# EAGLE board main (EAGLE 6.1)
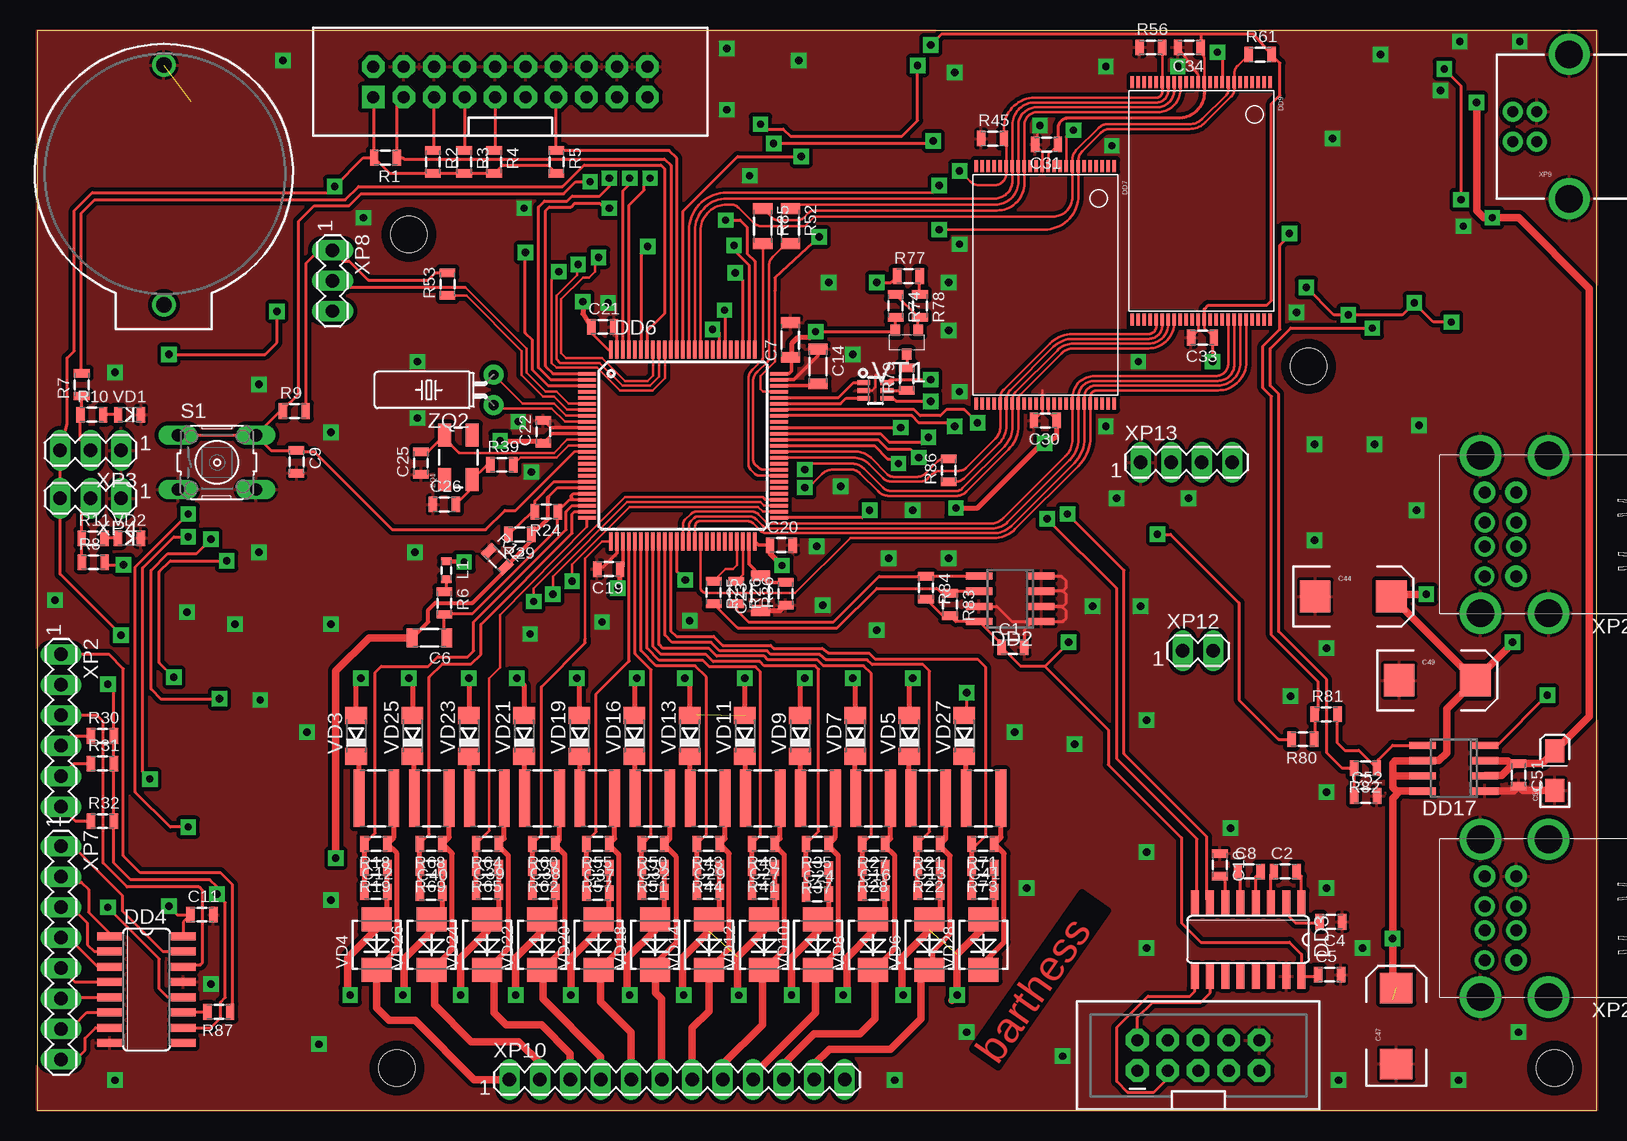
[diagram p5: board, top side]
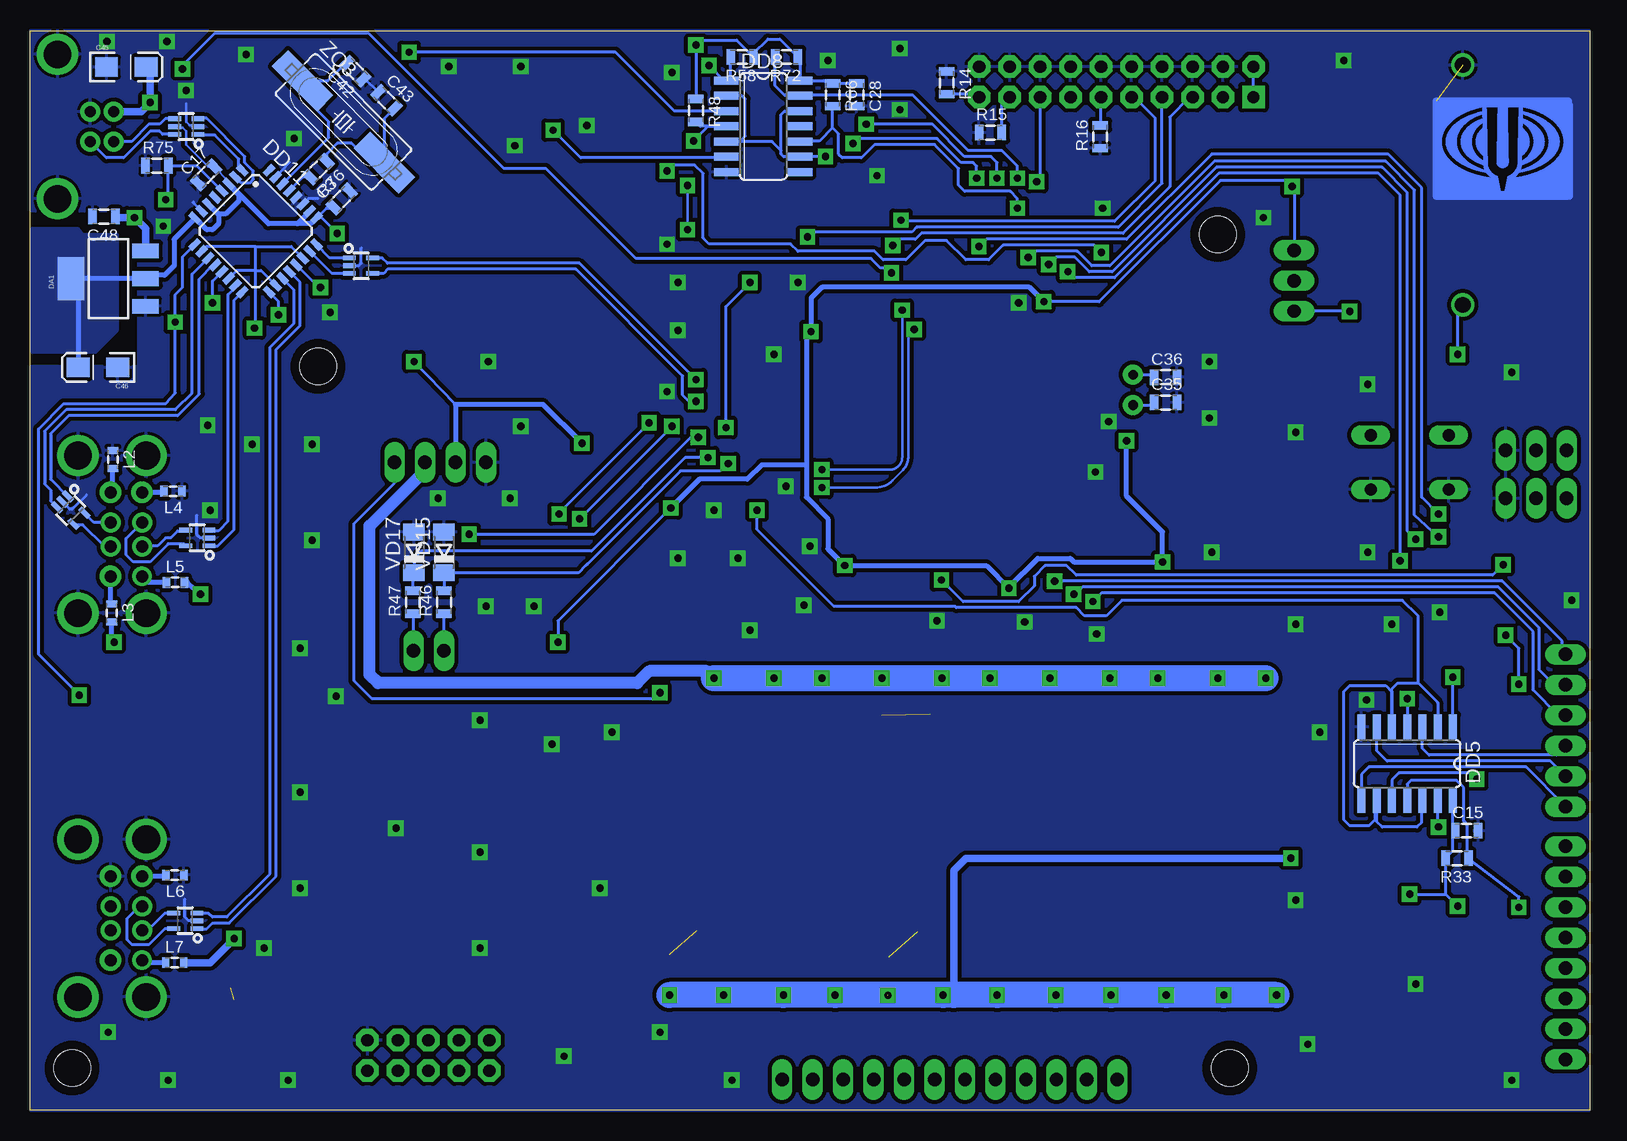
[diagram p6: board, bottom side, seen from below]

Size 130 x 90 mm. Coordinates in mm from the lower left corner, seen from the top.
Outline: 0,0 130,0 130,90 0,90 0,0
Copper layers (1*16): Top 0.035mm / dielectric 1.5mm / Bottom 0.035mm
Design rules: minimum track width 0.2mm, minimum drill 0.3mm, track to track 0.18mm, track to pad 0.15mm, pad to pad 0.15mm, via to via 0.15mm, smd to smd 0.15mm, copper to edge 0mil, drill to drill 30mil, minimum pad ring 12mil, minimum via ring 12mil, stop-mask expansion 4mil, vias tented up to drill 0mil, thermal gap 10mil
tRestrict: area 32.9,53.5 to 33.4,55
bRestrict: area 6.2,82.8 to 6.7,83.4; area 7.9,82.8 to 8.3,83.4

## Footprints (pad centres in the part's own frame; a part is rotated, then mirrored left to right if it is on the bottom)
BATTCOM_20MM_PTH = drill 1.3: 1 20,0; 2 0,0
0805 = smd 0.7 x 1.3: 1 -1,0; 2 0.9,0
1206 = smd 0.9 x 1.6: 1 -1.45,0; 2 1.45,0
EIA7343 = smd 2.55 x 2.7: A 3.17,0; C -3.17,0
EIA3216-KIT = smd 1.9 x 1.6: A 1.65,0; C -1.65,0
SOT223 = smd 1.219 x 2.235: 1 -2.311,-3.099; 2 0,-3.099; 3 2.311,-3.099 | smd 3.6 x 2.2: 4 0,3.099
SO-08 = smd 0.6 x 2.2: 1 -1.905,-2.6; 2 -0.635,-2.6; 3 0.635,-2.6; 4 1.905,-2.6; 5 1.905,2.6; 6 0.635,2.6; 7 -0.635,2.6; 8 -1.905,2.6
SO16 = smd 0.66 x 2.032: 1 -4.445,-3.073; 2 -3.175,-3.073; 3 -1.905,-3.073; 4 -0.635,-3.073; 5 0.635,-3.073; 6 1.905,-3.073; 7 3.175,-3.073; 8 4.445,-3.073; 9 4.445,3.073; 10 3.175,3.073; 11 1.905,3.073; 12 0.635,3.073; 13 -0.635,3.073; 14 -1.905,3.073; 15 -3.175,3.073; 16 -4.445,3.073
SO14 = smd 0.66 x 2.032: 1 -3.81,-3.073; 2 -2.54,-3.073; 3 -1.27,-3.073; 4 0,-3.073; 5 1.27,-3.073; 6 2.54,-3.073; 7 3.81,-3.073; 8 3.81,3.073; 9 2.54,3.073; 10 1.27,3.073; 11 0,3.073; 12 -1.27,3.073; 13 -2.54,3.073; 14 -3.81,3.073
TQFP100 = smd 1.5 x 0.3: 1 -8,6; 2 -8,5.5; 3 -8,5; 4 -8,4.5; 5 -8,4; 6 -8,3.5; 7 -8,3; 8 -8,2.5; 9 -8,2; 10 -8,1.5; 11 -8,1; 12 -8,0.5; 13 -8,0; 14 -8,-0.5; 15 -8,-1; 16 -8,-1.5; 17 -8,-2; 18 -8,-2.5; 19 -8,-3; 20 -8,-3.5; 21 -8,-4; 22 -8,-4.5; 23 -8,-5; 24 -8,-5.5; 25 -8,-6; 51 8,-6; 52 8,-5.5; 53 8,-5; 54 8,-4.5; 55 8,-4; 56 8,-3.5; 57 8,-3; 58 8,-2.5; 59 8,-2; 60 8,-1.5; 61 8,-1; 62 8,-0.5; 63 8,0; 64 8,0.5; 65 8,1; 66 8,1.5; 67 8,2; 68 8,2.5; 69 8,3; 70 8,3.5; 71 8,4; 72 8,4.5; 73 8,5; 74 8,5.5; 75 8,6 | smd 0.3 x 1.5: 26 -6,-8; 27 -5.5,-8; 28 -5,-8; 29 -4.5,-8; 30 -4,-8; 31 -3.5,-8; 32 -3,-8; 33 -2.5,-8; 34 -2,-8; 35 -1.5,-8; 36 -1,-8; 37 -0.5,-8; 38 0,-8; 39 0.5,-8; 40 1,-8; 41 1.5,-8; 42 2,-8; 43 2.5,-8; 44 3,-8; 45 3.5,-8; 46 4,-8; 47 4.5,-8; 48 5,-8; 49 5.5,-8; 50 6,-8; 76 6,8; 77 5.5,8; 78 5,8; 79 4.5,8; 80 4,8; 81 3.5,8; 82 3,8; 83 2.5,8; 84 2,8; 85 1.5,8; 86 1,8; 87 0.5,8; 88 0,8; 89 -0.5,8; 90 -1,8; 91 -1.5,8; 92 -2,8; 93 -2.5,8; 94 -3,8; 95 -3.5,8; 96 -4,8; 97 -4.5,8; 98 -5,8; 99 -5.5,8; 100 -6,8
TSOP48 = smd 1 x 0.3: 1 -0.7,11.8; 2 -0.7,11.3; 3 -0.7,10.8; 4 -0.7,10.3; 5 -0.7,9.8; 6 -0.7,9.3; 7 -0.7,8.8; 8 -0.7,8.3; 9 -0.7,7.8; 10 -0.7,7.3; 11 -0.7,6.8; 12 -0.7,6.3; 13 -0.7,5.8; 14 -0.7,5.3; 15 -0.7,4.8; 16 -0.7,4.3; 17 -0.7,3.8; 18 -0.7,3.3; 19 -0.7,2.8; 20 -0.7,2.3; 21 -0.7,1.8; 22 -0.7,1.3; 23 -0.7,0.8; 24 -0.7,0.3; 25 19.1,0.3; 26 19.1,0.8; 27 19.1,1.3; 28 19.1,1.8; 29 19.1,2.3; 30 19.1,2.8; 31 19.1,3.3; 32 19.1,3.8; 33 19.1,4.3; 34 19.1,4.8; 35 19.1,5.3; 36 19.1,5.8; 37 19.1,6.3; 38 19.1,6.8; 39 19.1,7.3; 40 19.1,7.8; 41 19.1,8.3; 42 19.1,8.8; 43 19.1,9.3; 44 19.1,9.8; 45 19.1,10.3; 46 19.1,10.8; 47 19.1,11.3; 48 19.1,11.8
SOTT323-6L = smd 1.05 x 0.4: 1 -1,0.65; 2 -1,0; 3 -1,-0.65; 4 0.95,-0.65; 5 0.95,0; 6 0.95,0.65
VF_S-PQFP-G32 = smd 1.05 x 0.5: 1 -4.375,2.8; 2 -4.375,2; 3 -4.375,1.2; 4 -4.375,0.4; 5 -4.375,-0.4; 6 -4.375,-1.2; 7 -4.375,-2; 8 -4.375,-2.8; 17 4.375,-2.8; 18 4.375,-2; 19 4.375,-1.2; 20 4.375,-0.4; 21 4.375,0.4; 22 4.375,1.2; 23 4.375,2; 24 4.375,2.8 | smd 0.5 x 1.05: 9 -2.8,-4.375; 10 -2,-4.375; 11 -1.2,-4.375; 12 -0.4,-4.375; 13 0.4,-4.375; 14 1.2,-4.375; 15 2,-4.375; 16 2.8,-4.375; 25 2.8,4.375; 26 2,4.375; 27 1.2,4.375; 28 0.4,4.375; 29 -0.4,4.375; 30 -1.2,4.375; 31 -2,4.375; 32 -2.8,4.375
SOTT323-5L = smd 1.05 x 0.4: 1 -1,0.65; 2 -1,0; 3 -1,-0.65; 4 0.95,-0.65; 5 0.95,0.65
STAND-OFF-TIGHT = hole 3.048: 0,0
0603 = smd 0.6 x 0.9: 1 -0.8,0; 2 0.7,0
1218 = smd 0.9 x 4.8: 1 -1.45,0; 2 1.45,0
B3F-10XX = drill 1.016 long: 1 -3.251,2.261; 2 3.251,2.261; 3 -3.251,-2.261; 4 3.251,-2.261
LED-0805 = smd 0.7 x 1.3: A -1,0; C 0.9,0
SOD80C = smd 1.4 x 1.8: A 1.7,0; C -1.7,0
SMB = smd 2 x 2.5: A 2.1,0; C -2.1,0
MICRO3 = smd 0.8 x 0.9: 1 -0.95,-1; 2 0.95,-1; 3 0,1
PLD_2X10_SHROUDED = drill 1.016 pad 1.88 square: 1 -1.27,11.43 | drill 1.016 pad 1.88 octagon: 2 1.27,11.43; 3 -1.27,8.89; 4 1.27,8.89; 5 -1.27,6.35; 6 1.27,6.35; 7 -1.27,3.81; 8 1.27,3.81; 9 -1.27,1.27; 10 1.27,1.27; 11 -1.27,-1.27; 12 1.27,-1.27; 13 -1.27,-3.81; 14 1.27,-3.81; 15 -1.27,-6.35; 16 1.27,-6.35; 17 -1.27,-8.89; 18 1.27,-8.89; 19 -1.27,-11.43; 20 1.27,-11.43
PLD_1X06_LONGPAD = drill 1.118 long: 1 0,0; 2 2.54,0; 3 5.08,0; 4 7.62,0; 5 10.16,0; 6 12.7,0
PLD_1X03_LONGPAD = drill 1.118 long: 1 0,0; 2 2.54,0; 3 5.08,0
2X5-SHROUDED = drill 1.016 pad 1.88 octagon: 1 -1.27,5.08; 2 1.27,5.08; 3 -1.27,2.54; 4 1.27,2.54; 5 -1.27,0; 6 1.27,0; 7 -1.27,-2.54; 8 1.27,-2.54; 9 -1.27,-5.08; 10 1.27,-5.08
PLD_1X08_LONGPAD = drill 1.118 long: 1 0,0; 2 2.54,0; 3 5.08,0; 4 7.62,0; 5 10.16,0; 6 12.7,0; 7 15.24,0; 8 17.78,0
USB-B-PTH = drill 0.914 pad 1.676: D+ 0,1.25; D- 1.981,1.25; GND 0,-1.25; VBUS 1.981,-1.25 | drill 2.286: S1 -2.718,-6.02; S2 -2.718,6.02
PLD_1X12_LONGPAD = drill 1.118 long: 1 0,0; 2 2.54,0; 3 5.08,0; 4 7.62,0; 5 10.16,0; 6 12.7,0; 7 15.24,0; 8 17.78,0; 9 20.32,0; 10 22.86,0; 11 25.4,0; 12 27.94,0
PLD_1X02_LONGPAD = drill 1.118 long: 1 0,0; 2 2.54,0
PLD_1X04_LONGPAD = drill 1.118 long: 1 0,0; 2 2.54,0; 3 5.08,0; 4 7.62,0
2_USB_A_ANGLE = drill 1 pad 1.676: 1D+ 2.71,-1; 1D- 2.71,1; 2D+ 5.33,-1; 2D- 5.33,1 | drill 1 pad 1.778: 1GND 2.71,-3.5; 1VBUS 2.71,3.5; 2GND 5.33,-3.5 | drill 1: 2VBUS 5.33,3.5 | drill 2.3: M1 0,6.57; M2 0,-6.57; M3 5.68,6.57; M4 5.68,-6.57
CRYSTAL-SMD-5X3 = smd 1.9 x 1.1: 1 -1.85,-1.15; 2 1.85,-1.15; 3 1.85,1.15; 4 -1.85,1.15
TC38H = drill 0.813 pad 1.676: 1 -1.27,0; 2 1.27,0
HC49UP = smd 5.334 x 1.93: 1 -4.826,0; 2 4.826,0

## Placement (x,y rotation side)
BAT1  3V  [BATTCOM_20MM_PTH]  10.57,87.12 270 top
C1  0.1uF  [0805]  81.4,38.6 0 top
C2  0.1uF  [0805]  104.1,19.9 0 top
C3  0.1uF  [0805]  104,76 45 bottom
C4  0.1uF  [0805]  107.8,15.7 180 top
C5  0.1uF  [0805]  107.8,11.3 0 top
C6  10uF  [1206]  32.71,39.37 180 top
C7  10uF  [1206]  62.8,64.2 90 top
C8  0.1uF  [0805]  101.1,19.9 0 top
C9  0.1uF  [0805]  21.63,54 270 top
C10  0.1uF  [0805]  98.6,20.4 270 top
C11  0.1uF  [0805]  13.8,16.3 0 top
C12  1uF/10v  [0805]  28.3,18.2 0 top
C13  1uF/10v  [0805]  74.4,18.2 0 top
C14  4.7uF  [1206]  65.1,62 270 top
C15  0.1uF  [0805]  10.2,23.3 0 bottom
C16  1uF/10v  [0805]  69.8,18.1 0 top
C17  0.1uF  [0805]  115.3,78 45 bottom
C19  0.1uF  [0805]  47.6,45.1 180 top
C20  0.1uF  [0805]  62.1,47.1 0 top
C21  0.1uF  [0805]  47.2,65.3 0 top
C22  0.1uF  [0805]  42.2,56.6 90 top
C23  4.7uF  [1206]  60.3,43.1 90 top
C24  1uF/10v  [0805]  65.1,18 0 top
C25  22pF/50v  [0805]  32,54 90 top
C26  22pF/50v  [0805]  34,50.5 0 top
C27  1uF/10v  [0805]  60.6,18.2 0 top
C28  0.1uF  [0805]  61.1,84.6 270 bottom
C29  1uF/10v  [0805]  56,18.2 0 top
C30  0.1uF  [0805]  84,57.5 180 top
C31  0.1uF  [0805]  84.1,80.5 180 top
C32  1uF/10v  [0805]  51.4,18.2 0 top
C33  0.1uF  [0805]  97.1,64.4 180 top
C34  0.1uF  [0805]  96,88.6 180 top
C35  10pF  [0805]  35.3,59 0 bottom
C36  10pF  [0805]  35.3,61.1 0 bottom
C37  1uF/10v  [0805]  46.8,18.1 0 top
C38  1uF/10v  [0805]  42.3,18.2 0 top
C39  1uF/10v  [0805]  37.6,18.2 0 top
C40  1uF/10v  [0805]  32.9,18.1 0 top
C41  1uF/10v  [0805]  78.9,18.2 0 top
C42  22pF/50v  [0805]  102.96,86.66 135 bottom
C43  22pF/50v  [0805]  100.26,84.16 315 bottom
C44  100uF/10v  [EIA7343]  109.72,42.82 0 top
C45  10uF/6.3v  [EIA3216-KIT]  121.98,86.96 0 bottom
C46  10uF/6.3v  [EIA3216-KIT]  124.34,61.92 180 bottom
C47  100uF/10v  [EIA7343]  113.3,7.02 90 top
C48  0.1uF  [0805]  123.9,74.5 180 bottom
C49  100uF/10v  [EIA7343]  116.72,35.84 0 top
C50  10uF/6.3v  [EIA3216-KIT]  126.52,28.3 90 top
C51  0.1uF  [0805]  123.5,27.9 270 top
C52  0.1uF  [0805]  110.8,26.2 0 top
DA1  LM1117  [SOT223]  123.48,69.32 90 bottom
DD2  24AA32ASN  [SO-08]  81.12,42.63 90 top
DD3  MAX3232CSE  [SO16]  100.95,14.22 180 top
DD4  74HC595D  [SO16]  9.12,10.05 270 top
DD5  74HC125D  [SO14]  15.21,28.88 180 bottom
DD6  STM32F103VDT6  [TQFP100]  53.84,55.39 0 top
DD7  K9LBG08U0D  [TSOP48]  78,78 270 top
DD8  74HC125D  [SO14]  68.88,82.02 270 bottom
DD9  K9LBG08U0D  [TSOP48]  91,85 270 top
DD10  USBUF01W6  [SOTT323-6L]  117,82 180 bottom
DD11  TUSB2046BVFR  [VF_S-PQFP-G32]  111.2,73.28 315 bottom
DD12  USBDF01W5  [SOTT323-5L]  126.6,50 315 bottom
DD13  USBUF01W6  [SOTT323-6L]  69.9,60 0 top
DD14  USBDF01W5  [SOTT323-5L]  102.4,70.4 0 bottom
DD15  USBDF01W5  [SOTT323-5L]  116.08,47.7 180 bottom
DD16  USBDF01W5  [SOTT323-5L]  117.08,15.78 180 bottom
DD17  TPS2041D  [SO-08]  118.1,28.5 90 top
JP1  STAND-OFFTIGHT  [STAND-OFF-TIGHT]  30,3.5 0 top
JP2  STAND-OFFTIGHT  [STAND-OFF-TIGHT]  126.5,3.5 0 top
JP6  STAND-OFFTIGHT  [STAND-OFF-TIGHT]  31,73 0 top
JP7  STAND-OFFTIGHT  [STAND-OFF-TIGHT]  106,62 0 top
L1  EXC3BP  [0603]  34.12,44.95 270 top
L2  EXC3BP  [0603]  123.1,54.18 270 bottom
L3  EXC3BP  [0603]  123.2,41.4 270 bottom
L4  EXC3BP  [0603]  118.14,51.6 180 bottom
L5  EXC3BP  [0603]  117.84,44 0 bottom
L6  EXC3BP  [0603]  117.98,19.6 180 bottom
L7  EXC3BP  [0603]  117.9,12.3 0 bottom
R1  10k  [0805]  29,79.4 180 top
R2  10k  [0805]  33,79 270 top
R3  10k  [0805]  35.6,79 270 top
R4  10k  [0805]  38.1,79 270 top
R5  10k  [0805]  43.3,79 270 top
R6  2.2  [0805]  33.95,42.22 270 top
R7  10k  [0805]  3.72,60.53 90 top
R8  10k  [0805]  4.74,45.68 0 top
R9  10k  [0805]  21.49,58.28 0 top
R10  100  [0805]  4.61,57.98 0 top
R11  100  [0805]  4.72,47.68 0 top
R12  0  [0805]  38.4,45.9 315 top
R14  10k  [0805]  53.6,85.6 270 bottom
R15  10k  [0805]  49.9,81.5 0 bottom
R16  10k  [0805]  40.8,81.2 90 bottom
R17  1k/1%  [1218]  28.3,26 180 top
R18  100k/1%  [0805]  28.2,22.2 180 top
R19  10k/1%  [0805]  28.2,20.2 180 top
R20  1k/1%  [1218]  74.3,26 180 top
R21  100k/1%  [0805]  74.3,22.2 180 top
R22  10k/1%  [0805]  74.3,20.2 180 top
R23  1k/1%  [1218]  69.7,26 180 top
R24  0  [0805]  42.4,49.9 180 top
R25  0  [0805]  56.4,43.1 270 top
R26  0  [0805]  58.3,43.1 270 top
R27  100k/1%  [0805]  69.7,22.2 180 top
R28  10k/1%  [0805]  69.7,20.2 180 top
R29  0  [0805]  40.2,48 180 top
R30  10k  [0805]  5.5,31.2 0 top
R31  10k  [0805]  5.5,28.9 0 top
R32  10k  [0805]  5.5,24.1 0 top
R33  10k  [0805]  11.1,21 180 bottom
R34  1k/1%  [1218]  65.1,26 180 top
R35  100k/1%  [0805]  65,22.2 180 top
R36  0  [0805]  62.4,43.1 90 top
R37  10k/1%  [0805]  65,20.1 180 top
R38  1k/1%  [1218]  60.5,26 180 top
R39  390  [0805]  38.8,53.8 0 top
R40  100k/1%  [0805]  60.5,22.2 180 top
R41  10k/1%  [0805]  60.5,20.2 180 top
R42  1k/1%  [1218]  55.9,26 180 top
R43  100k/1%  [0805]  55.9,22.2 180 top
R44  10k/1%  [0805]  55.9,20.2 180 top
R45  10k  [0805]  79.7,81 0 top
R46  10k  [0805]  95.5,42.4 90 bottom
R47  10k  [0805]  98.1,42.4 90 bottom
R48  10k  [0805]  74.5,83.3 270 bottom
R49  1k/1%  [1218]  51.3,26 180 top
R50  100k/1%  [0805]  51.3,22.2 180 top
R51  10k/1%  [0805]  51.3,20.2 180 top
R52  0  [1206]  62.8,73.7 270 top
R53  10k  [0805]  34.21,68.91 90 top
R54  1k/1%  [1218]  46.7,26 180 top
R55  100k/1%  [0805]  46.7,22.2 180 top
R56  10k  [0805]  92.9,88.6 0 top
R57  10k/1%  [0805]  46.7,20.2 180 top
R58  10k  [0805]  70.7,87.8 180 bottom
R59  1k/1%  [1218]  42.1,26 180 top
R60  100k/1%  [0805]  42.2,22.2 180 top
R61  10k  [0805]  102,88 0 top
R62  10k/1%  [0805]  42.2,20.2 180 top
R63  1k/1%  [1218]  37.5,26 180 top
R64  100k/1%  [0805]  37.5,22.2 180 top
R65  10k/1%  [0805]  37.5,20.2 180 top
R66  10k  [0805]  63.1,84.6 270 bottom
R67  1k/1%  [1218]  32.9,26 180 top
R68  100k/1%  [0805]  32.8,22.2 180 top
R69  10k/1%  [0805]  32.8,20.2 180 top
R70  1k/1%  [1218]  78.9,26 180 top
R71  100k/1%  [0805]  78.8,22.2 180 top
R72  10k  [0805]  67,87.8 180 bottom
R73  10k/1%  [0805]  78.8,20.2 180 top
R74  10k  [0805]  71.56,67 270 top
R75  10k  [0805]  119.38,78.74 0 bottom
R76  1.5k  [0805]  106,78.4 225 bottom
R77  0  [0805]  72.69,69.53 0 top
R78  1.5k  [0805]  73.6,67 270 top
R79  1.5k  [0805]  72.5,61 90 top
R80  10k  [0805]  105.46,30.92 180 top
R81  1k  [0805]  107.5,33 0 top
R82  10k  [0805]  110.68,28.5 180 top
R83  1.5k  [0805]  76.1,42.1 270 top
R84  1.5k  [0805]  74.1,43.5 270 top
R85  0  [1206]  60.5,73.7 270 top
R86  0  [0805]  76,53.4 90 top
R87  0  [0805]  15.1,8.2 180 top
S1  [B3F-10XX]  15,54 0 top
VD1  RED  [LED-0805]  7.76,57.98 0 top
VD2  RED  [LED-0805]  7.75,47.68 0 top
VD3  BAS85  [SOD80C]  26.6,31.2 90 top
VD4  SM6T30A  [SMB]  28.3,13.8 90 top
VD5  BAS85  [SOD80C]  72.7,31.2 90 top
VD6  SM6T30A  [SMB]  74.4,13.8 90 top
VD7  BAS85  [SOD80C]  68.2,31.2 90 top
VD8  SM6T30A  [SMB]  69.7,13.8 90 top
VD9  BAS85  [SOD80C]  63.6,31.2 90 top
VD10  SM6T30A  [SMB]  65.1,13.8 90 top
VD11  BAS85  [SOD80C]  59,31.2 90 top
VD12  SM6T30A  [SMB]  60.6,13.8 90 top
VD13  BAS85  [SOD80C]  54.4,31.2 90 top
VD14  SM6T30A  [SMB]  56,13.8 90 top
VD15  BZV55-C3V3  [SOD80C]  95.5,46.5 90 bottom
VD16  BAS85  [SOD80C]  49.8,31.2 90 top
VD17  BZV55-C3V3  [SOD80C]  98,46.5 90 bottom
VD18  SM6T30A  [SMB]  51.5,13.8 90 top
VD19  BAS85  [SOD80C]  45.2,31.2 90 top
VD20  SM6T30A  [SMB]  46.8,13.8 90 top
VD21  BAS85  [SOD80C]  40.6,31.2 90 top
VD22  SM6T30A  [SMB]  42.1,13.8 90 top
VD23  BAS85  [SOD80C]  36,31.2 90 top
VD24  SM6T30A  [SMB]  37.5,13.8 90 top
VD25  BAS85  [SOD80C]  31.3,31.2 90 top
VD26  SM6T30A  [SMB]  32.9,13.8 90 top
VD27  BAS85  [SOD80C]  77.3,31.2 90 top
VD28  SM6T30A  [SMB]  78.9,13.8 90 top
VT1  IRLML5103  [MICRO3]  72.5,64.02 180 top
XP1  2X10-SHROUDED  [PLD_2X10_SHROUDED]  39.45,85.72 90 top
XP2  [PLD_1X06_LONGPAD]  2,38 270 top
XP3  [PLD_1X03_LONGPAD]  7,55 180 top
XP4  [PLD_1X03_LONGPAD]  7,51 180 top
XP5  M05X2SHD  [2X5-SHROUDED]  96.8,4.56 90 top
XP7  [PLD_1X08_LONGPAD]  2,22 270 top
XP8  [PLD_1X03_LONGPAD]  24.63,71.69 270 top
XP9  USB-B  [USB-B-PTH]  125,82 180 top
XP10  [PLD_1X12_LONGPAD]  39.37,2.54 0 top
XP12  [PLD_1X02_LONGPAD]  95.5,38.3 0 top
XP13  [PLD_1X04_LONGPAD]  92,54 0 top
XP22  USB_2PSHIELD-  [2_USB_A_ANGLE]  126,48 180 top
XP23  USB_2PSHIELD-  [2_USB_A_ANGLE]  126,16 180 top
ZQ1  12M  [CRYSTAL-SMD-5X3]  35.12,54.42 90 top
ZQ2  32k  [TC38H]  38.06,60.04 90 top
ZQ3  6M  [HC49UP]  103.88,82.4 315 bottom

## Tracks (layer width: path | path; a pad name or v marks a point on that pad's centre or on a via)
3.3V  (via drill 0.6 pad 1.27)
  Top 0.2: C34.1 97.3,87.7 DD9.12 | C31.1 84.3,79.7 DD7.12 | DD9.37 97.3,65.2 C33.1 | DD7.37 84.3,58.2 C30.1
  Top 0.25: C31.1 85.1,81.94 arc-90 86.06,82.7 95.26,82.7 arc90 97.3,84.94 DD9.12 | C5.1 106.65,11.15 DD3.16 105.39,13.01 104.4,14 97,14 95.4,15.6 95.4,22.7 89.3,28.8 89.3,31.7 84,37 | 62.9,62.65 C7.1 | C22.1 42.99,56.39 | DD4.16 12.19,15.69 C11.1 11.7,16.3 v11,17 | R1.2 28.1,84.37 XP1.1 | DD4.10 14.47,6.88 15.3,7.7 15.3,9 15.7,9.4 15.7,17.3 v15,18 15,18.6 14.4,19.2 7.8,19.2 6.4,20.6 R32.2 R31.2 R30.2 6.4,35 v5.9,35.5 | R5.2 42.6,78.8 38.8,78.8 R4.2 R3.2 R2.2 29.4,78.1 R1.2 | v98,62.4 98,63.8 C33.1 | C19.1 48.84,45.34 | R74.2 VT1.2 71.43,64.9 v64.9,64.9 | R84.2 75.5,41.2 R83.2 76.58,40.73 DD2.8 80.4,38.84 C1.1 82,37 84,37 | v86,39 84,37 | R1.2 27.2,79.4 v24.8,77 24.3,76.5 4.6,76.5 3.1,75 3.1,63.3 2.5,62.7 2.5,57.2 XP3.3 | R53.2 33.21,69.81 32.6,69.2 27.6,69.2 26,70.8 25.52,70.8 XP8.1 23.5,71.7 22.39,70.59 R9.2 | XP3.3 2,55.08 | XP3.3 XP4.3 1.92,44.68 v7,39.6 | 97,89.7 101.4,89.7 R61.2 103.6,87.3 103.6,84.6 102.9,83.9 102.9,67.5 102.5,67.1 97.6,67.1 97.3,66.8 DD9.37 | 97,89.7 75.4,89.7 v74.5,88.8 | 97,89.7 C34.1 | DD6.100 47.61,63.39 46,65 46,65.1 C21.1
  Top 0.3: DD6.75 62.69,61.39 62.9,61.6 62.9,62.65 | 42.99,56.39 DD6.11 | C20.1 60.13,47.1 DD6.50 | 48.84,45.34 DD6.28
  Top 0.406: 85,57 C30.1 85,56.1 v84,55.6 83.8,55.6 78.4,50.2 v76.6,50.2 | 62.9,62.65 62.9,63.9 63.4,64.4 64.4,64.4 v64.9,64.9 | C20.1 61.1,46.4 v62.1,45.4 | C19.1 48.6,43.7 v48.4,43.5 | C22.1 42,55.8 v38.6,55.8 | v45.5,67.4 45.5,66.4 C21.1 | v35.6,45.7 35.02,45.7 L1.1
  Bottom 0.25: DD5.14 11.4,23.5 C15.1 11.4,23.1 11.4,21.6 R33.2 12,18 | C28.1 R66.1 63.5,85.5 63.83,85.83 DD8.14 65.81,87.61 R72.1 67.5,89.3 68.5,89.3 69.7,88.1 R58.1 71.1,89.2 74.1,89.2 v74.5,88.8 R48.1 | 28.2,84.27 XP1.1 XP1.2 | v15,18 12,18 | 12,18 v11,17 | 94.54,58.84 v98,62.4 | v76.6,50.2 86,40.8 v86,39 | XP8.1 24.63,76.83 v24.8,77 25.3,77.5 30.8,77.5 40.9,67.4 v45.5,67.4 | v5.9,35.5 5.9,38.5 v7,39.6
  Bottom 0.406: 65.3,53.8 65.3,51.1 63.5,49.3 63.5,46.8 v62.1,45.4 50.3,45.4 v48.4,43.5 48.4,43.6 46,46 43.3,46 43,45.7 v35.6,45.7 35.6,48.2 38.6,51.2 v38.6,55.8 | 65.3,53.8 65.3,64.5 v64.9,64.9 64.9,67.7 64,68.6 46.7,68.6 v45.5,67.4 | XP13.2 94.54,58.84 87.24,58.84 v84,55.6 | v76.6,50.2 74.2,52.6 70.2,52.6 69,53.8 65.3,53.8
3.3V_USB  (via drill 0.6 pad 1.27)
  Top 0.25: v104.4,73.1 104.4,72.9 103.6,72.1 103.6,65.1 102.2,63.7 102.2,60.2 102.9,59.5 102.9,39.6 106.8,35.7 106.8,33.3 R81.1 106.5,30.96 R80.1
  Bottom 0.2: DD10.5 117.85,81.9 117.3,81.9 117,81.6 117,80.5 115.14,78.64 C17.2 113.44,77.42 DD11.3
  Bottom 0.25: v104.4,73.1 105.69,74.39 DD11.25 106.11,74.39 105.3,75.2 104.8,75.2 C3.1
  Bottom 0.406: 126,69.32 DA1.2 120.1,69.6 118.8,69.6 118,70.4 118,72.6 116.27,74.33 DD11.8 115.28,73.4 114.8,73.4 114.3,73.9 114.3,74.7 115.12,75.53 DD11.6 114.32,74.7 113.7,74.7 112.6,75.8 112.6,76.3 113.44,77.14 DD11.3 110.12,73.9 107.7,73.9 | 126,69.32 DA1.4 | 107.7,73.9 106.69,74.91 DD11.26 | DD11.25 106.62,73.9 107.7,73.9 | C46.A 126,69.32
  pour Bottom (isolate 0.3, no thermals): 122.7,73 125.6,73 126,73.5 129.9,73.5 129.9,63.2 124.5,63.2 122.7,65
5V_USB  (via drill 0.6 pad 1.27)
  Top 0.61: 122.8,28.9 C51.1 125.47,28.9 C50.A 129.4,32.83 129.4,68.5 123.5,74.4 v121.3,74.4 120.6,74.4 120,75 v120,84 | 122.8,28.9 122.6,29.1 120.73,29.1 DD17.3 | DD17.2 120.73,27.9 122.1,27.9 122.8,28.6 122.8,28.9
  Bottom 0.61: DA1.3 120.38,73.48 v121.3,74.4 122.8,74.4 C48.1 | C45.A 120,86.63 v120,84 120.75,83.25 XP9.VBUS
!USB_HUB_RESET  (via drill 0.6 pad 1.27)
  Top 0.25: v117.3,86.8 118.7,85.4 v118.7,75.9 | DD6.78 58.84,69.16 v58.2,69.8
  Bottom 0.25: DD11.4 116.09,78.74 R75.2 118.48,76.12 v118.7,75.9 | v117.3,86.8 117.3,87.1 114.6,89.8 101.8,89.8 90.5,78.5 87,78.5 79.5,71 59.9,71 59.1,70.2 58.6,70.2 v58.2,69.8
+24V  (via drill 0.6 pad 1.27)
  Top 0.25: VD27.A 77.5,33.1 v77.5,34.8
  Bottom 0.25: 77.6,34.7 v77.5,34.8 78,34.3 101.5,34.3 103,35.8 103,48.9 99.62,52.28 XP13.4
+ADCV  (via drill 0.6 pad 1.27)  (1 unrouted)
  Top 0.406: VD5.A 72.7,35.7 v73,36 | VD3.A 26.6,35.6 v27,36 | VD25.A 31.3,35.7 v31,36 | v36,36 VD23.A | VD19.A 45.2,35.8 v45,36 | VD16.A 49.8,35.8 v50,36 | 55,33 54.9,32.9 VD13.A 54.4,35.6 v54,36 | VD9.A 63.6,35.6 v64,36 | VD7.A 68.2,35.8 v68,36 | VD21.A 40.6,35.4 v40,36 | VD11.A v59,36
  Bottom 0.61: v73,36 73.6,36.6
  Bottom 1.016: XP13.3 97.08,53.32 101.7,48.7 101.7,36.3 101,35.6 79.4,35.6 78.4,36.6 73.6,36.6
  Bottom 2.184: v27,36 v31,36 v36,36 v40,36 v45,36 v50,36 v54,36 v64,36 v68,36 v73,36
A_IN0
  Top 0.25: R68.2 32.7,23 32.7,36.1 33.8,37.2 36.2,37.2 37,38 37,40.5 44.6,48.1 44.6,49.7 44.8,49.9 DD6.24
  Top 0.406: R68.2 R69.2 C40.1
A_IN1
  Top 0.2: 45.84,48.64 38.6,41.3 38.6,36.9 37.7,36 37.7,23.3
  Top 0.25: 45.84,48.64 DD6.25 | R64.2 37.7,23.3
  Top 0.406: R64.2 R65.2 C39.1
A_IN2
  Top 0.2: DD6.26 47.1,47.4 45.7,46 45.7,39.3
  Top 0.25: R60.2 42.05,22.95 42.05,35.3 45.7,38.95 45.7,39.3
  Top 0.406: R60.2 R62.2 C38.1
A_IN3
  Top 0.25: DD6.29 49.3,47.35 49.35,47.3 49.35,37.45 arc-90 49.3,37.4 46.6,34.7 46.6,23.2 45.8,22.4 R55.2
  Top 0.406: R55.2 R57.2 C37.1
A_IN4
  Top 0.25: DD6.30 49.85,38.05 51.2,36.7 51.2,22.9 50.5,22.2 R50.2
  Top 0.406: R50.2 R51.2 C32.1
A_IN5
  Top 0.25: R43.2 55.8,23 55.8,36.1 54.85,37.05 51.6,37.05 50.34,38.31 DD6.31
  Top 0.406: R43.2 R44.2 C29.1
A_IN6
  Top 0.25: R40.2 60.3,22.9 60.3,36.55 59.9,36.95 56.05,36.95 55.5,37.5 51.85,37.5 50.84,38.51 DD6.32
  Top 0.406: R40.2 R41.2 C27.1
A_IN7
  Top 0.25: R35.2 65.15,23.25 65.15,36.75 64.85,37.05 60.6,37.05 60.25,37.4 56.35,37.4 55.75,38 52,38 51.34,38.66 DD6.33
  Top 0.406: R35.2 R37.2 C24.1
A_IN8
  Top 0.25: R18.2 28.2,23.1 28.2,36.5 28.7,37 32.6,37 33.4,37.8 35.9,37.8 36.4,38.3 36.4,40.7 44.1,48.4 44.1,49.9 44.59,50.39 DD6.23
  Top 0.406: R18.2 R19.2 C12.1
A_IN9
  Top 0.25: 77.9,21.7 79.05,22.85 79.05,36.95 78.4,37.6 69.85,37.6 69.35,38.1 65.95,38.1 65.45,38.5 61.4,38.5 61.15,38.75 57.15,38.75 56.4,39.5 53.3,39.5 52.84,39.91 DD6.36
  Top 0.406: R71.2 77.9,21.7 R73.2 C41.1
A_IN14
  Top 0.25: R27.2 69.55,22.95 69.55,36.4 68.9,37.05 65.55,37.05 65.05,37.55 60.9,37.55 60.6,37.85 56.65,37.85 56,38.5 52.15,38.5 51.84,38.81 DD6.34
  Top 0.406: R27.2 R28.2 C16.1
A_IN15
  Top 0.25: R21.2 74.4,23.2 74.4,36.6 73.85,37.15 69.6,37.15 69.2,37.55 65.8,37.55 65.25,38 61.15,38 60.85,38.3 56.9,38.3 56.2,39 52.95,39 52.34,39.61 DD6.35
  Top 0.406: C13.1 R22.2 R21.2
BOOT_0
  Top 0.25: DD6.94 50.84,64.94 52.3,66.4 52.3,78.5 52,78.8 45.6,78.8 43.8,77 26.8,77 25.7,75.9 4.8,75.9 3.7,74.8 3.7,61.45 R7.2
BOOT_1  (via drill 0.6 pad 1.27)
  Top 0.25: v7.21,45.47 5.85,45.47 R8.2 | DD6.37 53.34,44.89 v54.03,44.2
  Bottom 0.25: v54.03,44.2 52.23,42.4 47.6,42.4 46.3,43.7 46.3,44.5 45.4,45.4 43.6,45.4 42.8,44.6 8.07,44.6 v7.21,45.47
FROM_COM
  Top 0.25: DD3.10 97.8,11.12 97.8,9.8 97,9 93,9 91.72,7.72 XP5.2
FROM_USART1  (via drill 0.6 pad 1.27)
  Top 0.25: DD6.68 72.91,57.89 73.5,57.3 76.2,57.3 v76.5,57 | 96.41,17.2 DD3.8 96.7,17.49 96.7,22.6 90,29.3 90,43.5 v84.2,49.3
  Bottom 0.25: v84.2,49.3 v76.5,57
FSMC_A16
  Top 0.2: DD9.16 95.3,85.06 arc-90 93.44,83.2 83.36,83.2 arc90 82.3,82.14 DD7.16 82.3,77.28 arc-90 80.02,75 64.83,75 arc45 64.28,74.77 63.92,74.41 arc-45 63.41,74.2 61.79,74.2 arc-45 61.21,74.44 R85.1
FSMC_A17
  Top 0.2: DD9.17 94.8,85.09 arc-90 93.31,83.6 83.29,83.6 arc90 81.8,82.11 DD7.17 81.8,77.42 arc-90 79.88,75.5 63.15,75.5 arc90 R52.1
FSMC_D0
  Top 0.2: DD9.29 93.3,65.37 arc-90 92.63,64.7 86.31,64.7 arc45 84.41,63.91 80.59,60.09 arc45 80.3,59.39 DD7.29 80.3,56.99 arc-45 79.88,55.98 77.45,53.55 arc-45 76.85,53.3 75.31,53.3 arc45 74.61,53.01 74.28,52.68 arc-45 73.61,52.4 71.23,52.4 arc-45 70.5,52.7 69.34,53.86 arc45 68.04,54.4 62.4,54.4 62.39,54.39 DD6.61
FSMC_D1
  Top 0.2: DD9.30 93.8,65.44 arc-90 92.66,64.3 86.33,64.3 arc45 84.74,63.64 81.14,60.04 arc45 80.8,59.22 DD7.30 80.8,57.02 arc-45 80.22,55.62 77.25,52.65 arc-45 76.65,52.4 R86.1
FSMC_D2  (via drill 0.6 pad 1.27)
  Top 0.2: DD9.31 94.3,65.54 arc-90 92.66,63.9 86.4,63.9 arc45 85.03,63.33 81.56,59.86 arc45 81.3,59.23 DD7.31 81.3,56.95 arc-45 80.63,55.33 77.15,51.85 arc-45 76.54,51.6 71.23,51.6 arc-45 70.49,51.91 68.92,53.48 arc45 67.91,53.9 64.5,53.9 v64,53.4 64.3,53.4 | DD6.81 57.3,63.43
  Top 0.25: DD6.81 57.34,67.06 v57.3,66.7
  Bottom 0.2: v64,53.4 58.25,53.4 arc-45 57.65,53.65 57.62,53.68 arc-45 57.3,54.45 v57.3,66.7
FSMC_D3  (via drill 0.6 pad 1.27)
  Top 0.2: DD9.32 94.8,65.66 arc-90 92.64,63.5 86.39,63.5 arc45 85.38,63.08 81.97,59.67 arc45 81.8,59.26 DD7.32 81.8,57.06 arc-45 80.98,55.08 77.45,51.55 arc-45 76.6,51.2 71.06,51.2 arc-45 70.1,51.6 68.61,53.09 arc45 67.86,53.4 66.33,53.4 arc45 65.43,53.03 64.7,52.3 64.4,52.3 v64,51.9
  Top 0.25: DD6.82 56.84,64.86 v56.3,65.1
  Bottom 0.2: v64,51.9 59.52,51.9 arc-45 58.12,52.48 57.22,53.38 arc-45 56.8,54.39 56.8,64.9 v56.3,65.1
FSMC_D4
  Top 0.2: DD6.38 53.84,48.79 arc-45 54.02,49.22 54.52,49.72 arc-45 54.96,49.9 59.58,49.9 arc-45 60.13,49.67 60.75,49.05 arc45 61.11,48.9 79.47,48.9 arc45 80.55,49.35 85.74,54.54 arc45 86.3,55.9 DD7.41 86.3,59.36 arc-90 88.14,61.2 98.27,61.2 arc90 99.3,62.23 DD9.41
FSMC_D5
  Top 0.2: DD6.39 54.34,48.69 arc-45 54.52,49.12 54.75,49.35 arc-45 55.11,49.5 59.34,49.5 arc-45 59.95,49.25 60.45,48.75 arc45 61.05,48.5 79.62,48.5 arc45 80.9,49.03 86.06,54.19 86.09,54.19 arc45 86.8,55.9 DD7.42 86.8,59.46 arc-90 88.14,60.8 98.44,60.8 arc90 99.8,62.16 DD9.42
FSMC_D6
  Top 0.2: DD6.40 54.84,48.6 arc-45 55.01,49.01 55.02,49.02 arc-45 55.22,49.1 59.26,49.1 arc-45 59.67,48.93 60.25,48.35 arc45 60.85,48.1 79.75,48.1 arc45 81.2,48.7 86.47,53.97 arc45 87.3,55.98 DD7.43 87.3,59.46 arc-90 88.24,60.4 98.41,60.4 arc90 100.3,62.29 DD9.43
FSMC_D7
  Top 0.2: DD6.41 55.3,47.35 55.3,43.6 arc90 55.8,43.1 63.2,43.1 67.8,47.7 79.76,47.7 arc45 81.53,48.43 86.81,53.71 arc45 87.8,56.1 DD7.44 87.8,59.46 arc-90 88.34,60 98.44,60 arc90 100.8,62.36 DD9.44
FSMC_NCE2  (via drill 0.6 pad 1.27)
  Top 0.25: DD6.88 53.84,74.94 58.4,79.5 v63.69,79.5
  Bottom 0.25: 67.4,80 67.4,79.7 67.18,79.48 DD8.9 63.72,79.48 v63.69,79.5 | 67.4,80 67.4,83 67.1,83.3 DD8.12 | DD8.2 70.66,84.56 70.4,84.3 70.4,81.2 70.8,80.8 71.9,80.8 DD8.5 68.15,80.75 67.4,80
FSMC_NOE
  Top 0.2: DD6.85 55.3,63.43 55.3,73.28 arc-90 57.52,75.5 57.84,75.5 arc-45 58.45,75.25 59.71,73.99 arc45 60.41,73.7 63.99,73.7 64.79,74.5 84.69,74.5 arc90 86.3,76.11 DD7.8 86.3,79.25 arc-45 86.61,80.02 88.48,81.88 arc-45 89.25,82.2 96.07,82.2 arc45 97.15,82.65 99.12,84.62 arc45 99.3,85.05 DD9.8
FSMC_NWAIT  (via drill 0.6 pad 1.27)
  Top 0.2: DD6.87 54.34,73.34 arc-90 57.49,76.5 74.7,76.5 v75.2,77.1 | 101,88.32 R61.1 100.08,87.08 arc45 99.8,86.41 DD9.7 99.8,85.15 arc-45 99.53,84.49 97.38,82.34 arc-45 96.07,81.8 89.5,81.8 arc45 88.65,81.45 87.13,79.93 arc45 86.8,79.14 DD7.7 86.8,76.24 arc-90 83.96,73.4 v75.2,73.4
  Bottom 0.2: v75.2,77.1 v75.2,73.4
FSMC_NWE
  Top 0.2: DD9.18 94.3,85 arc-90 93.3,84 83.16,84 arc90 81.3,82.14 DD7.18 81.3,77.48 arc-90 79.82,76 57.5,76 arc90 54.84,73.34 DD6.86
GND  (via drill 0.6 pad 1.27)  (1 unrouted)
  Top 0.2: C34.2 96.8,86.3 DD9.13 | DD13.2 69.6,60 69.9,60.3 69.9,61.3 | v83.6,82.1 C31.2 83.8,79.9 DD7.13 | DD9.36 96.8,65 C33.2 | C30.2 83.8,58.2 DD7.36 83.8,60
  Top 0.25: 65.1,62.9 C14.1 | DD6.74 | C22.2 42.81,56.89 | DD4.13 12.21,10.7 | DD2.4 83.75,44.5 85.4,44.5 85.8,44.1 85.8,43.6 85.5,43.3 | 85.5,43.3 85.47,43.27 DD2.3 83.75,43.3 85.5,43.3 | 85.5,43.3 85.8,43 85.8,42.3 85.5,41.99 DD2.2 85.4,42 85.8,41.6 85.8,41 85.53,40.73 DD2.1 83,40.73 | 82.3,39.3 C1.2 82.3,40.02 83,40.73 | 83,40.73 81.28,40.73 80,42 DD2.7 | DD6.99 48.34,65.06 C21.2
  Top 0.3: 65.1,62.9 63.1,60.9 DD6.74 | 42.81,56.89 DD6.10 | DD6.27 48.34,46.44 47.2,45.3 46.9,45.3 C19.2
  Top 0.406: R36.1 61.95,41.65 C23.1
  Top 0.61: DD17.1 123.09,26.59 C51.2 123.85,26.65 C50.C
  Bottom 0.2: DD10.2 116.1,82.1 116.7,82.1 117,82.4 117,83.9
  Bottom 0.25: C42.1 102.05,85.95 C43.1 | DD11.27 106.78,76 106,76 | DD11.31 108.4,79 | DD14.2 102.6,70.4 102.4,70.6 102.4,71.9 | DD11.7 116.4,75.65 116.4,75.7 | DD15.2 115.8,47.7 116.1,48 116.1,49.6 | DD12.2 126.7,50.1 126.5,50.1 125.3,51.3 | DD16.2 116.1,15.8 116.8,15.8 117.1,16.1 117.1,17.6
  Bottom 0.61: 1.8,84.1 12.8,84.1 12.8,76.2 1.7,76.2 1.7,83.8
  other vias: 31.7,57.7 31.7,62.4 40.1,57.4 76,65 76,69 66,69 68,63 91.8,62.4 89.1,57 76.9,59.9 96,51 90,51 65.5,42.1 71,46 70,40 88,42 92,42 76,46 65,47 47.1,40.7 41.2,53.2 118.6,89.1 112,88 108,81 118.9,73.7 115.2,57.1 115,50 106.5,55.5 111.5,55.5 123.6,89.1 106.5,47.5 104.5,34.5 92.5,32.5 99.5,23.5 107.5,18.5 107.5,26.5 110.5,13.5 123.5,6.5 118.5,2.5 108.5,2.5 85.5,4.5 71.5,2.5 92.5,13.5 92.5,21.5 86.5,30.5 81.5,31.5 82.5,18.5 77.5,6.5 76.5,86.5 89.1,87 63.5,87.5 57.5,88.5 20.5,87.5 6.5,61.5 18.5,60.5 24.5,56.5 18.5,46.5 31.5,46.5 16.5,40.5 24.5,40.5 18.6,34.2 6.5,2.5 14.5,10.5 12.5,41.5 27.2,74.4 40.6,75.2 57.5,83.4 59.4,77.9 22.5,31.5 1.5,42.5 47.6,67.3 76.9,72.2 117,85 24.5,17.5 23.5,5.5 89.6,80.4 107.5,38.5 95.1,87 41.1,39.7 67,52 73,50 54.4,40.8 105,66.5
  pour Bottom (isolate 0.333): 0,90 130,90 130,75 121,75 121,62 130,62 130,0 0,0
  pour Top (isolate 0.333): 0,90 130,90 130,0 0,0
GND_A  (via drill 0.6 pad 1.27)  (3 unrouted)
  Top 0.25: DD6.20 43.4,51.9 42.6,51.1 | v58.5,9.57 58.53,9.6 59,9.6
  Top 0.333: 42.6,51.1 42.6,49.3 R29.1 41.2,47.43 R12.2 39.04,45.04 36.3,42.3 33.2,42.3 32.6,41.7 32.6,40.71 C6.2
  Top 0.406: R69.1 C40.2 33.8,16.8 arc-90 VD26.A | R65.1 C39.2 38.5,16.9 arc-90 VD24.A | R62.1 C38.2 43.2,17 arc-90 VD22.A | R57.1 C37.2 47.7,15.9 VD20.A | R51.1 C32.2 52.3,16 VD18.A | R44.1 C29.2 56.9,16.6 arc-90 VD14.A | R41.1 C27.2 61.5,15.9 VD12.A | VD10.A 66,15.7 C24.2 R37.1 | R28.1 C16.2 70.7,16.8 arc-90 VD8.A | R22.1 C13.2 75.3,15.9 VD6.A | R19.1 C12.2 29.2,16.8 VD4.A | R73.1 C41.2 79.8,16 VD28.A 78.9,15.6
  Top 0.61: 78.9,15.6 78.9,15.2 76.7,13 v76.7,9.6 76.26,9.16 | VD10.A 65.1,14.9 62.9,12.7 v62.9,9.6 | VD6.A 74.4,15 72.1,12.7 72.1,9.7 v72.2,9.6 | VD8.A 69.7,14.9 67.5,12.7 67.5,9.9 v67.2,9.6 | VD12.A 60.6,15 58.4,12.8 58.4,9.7 58.5,9.6 | VD14.A 56,14.9 53.8,12.7 53.8,9.7 v53.9,9.6 | VD18.A 51.5,15 49.2,12.7 49.2,9.8 v49.4,9.6 | VD20.A 46.8,15 44.5,12.7 v44.5,9.6 | VD22.A 42.1,14.9 39.9,12.7 v39.9,9.6 | VD24.A 37.5,14.9 35.3,12.7 v35.3,9.6 | VD26.A 32.9,14.9 30.6,12.6 30.6,9.7 v30.5,9.6 | VD4.A 28.3,15.1 25.9,12.7 25.9,9.8 v26.1,9.6 | v24.9,21 24.9,36.6 27.67,39.37 C6.2
  Bottom 0.61: v24.9,21 52,21 53,20 53,9.6
  Bottom 2.184: v26.1,9.6 v30.5,9.6 v35.3,9.6 v39.9,9.6 v44.5,9.6 v49.4,9.6 53,9.6 v53.9,9.6 v62.9,9.6 v67.2,9.6 v76.7,9.6
I2C_SCL
  Top 0.25: DD2.6 76.27,43.27 R83.1 75.4,43.1 75,43.5 70,43.5 66.7,40.2 58.4,40.2 R25.2
I2C_SDA
  Top 0.25: DD2.5 74.14,44.53 R84.1 70.2,44.5 66.4,40.7 59.3,40.7 58.3,41.7 R26.2
N$1
  Top 0.2: DD6.9 44.01,57.39 42.9,58.5 38.33,58.5 ZQ2.1
  Bottom 0.25: C35.1 36.53,58.77 ZQ2.1
N$2
  Top 0.25: VD2.A R11.2
N$3
  Top 0.25: XP4.2 3.72,50.26 R11.1 3.74,47.66 R8.1
N$4
  Top 0.25: VD1.A R10.2
N$5
  Top 0.25: XP3.2 3.61,55.85 R10.1 3.72,58.09 R7.1
N$6
  Top 0.2: DD6.8 44.11,57.89 43.1,58.9 40.47,58.9 ZQ2.2
  Bottom 0.25: C36.1 36.51,61.31 ZQ2.2
N$7
  Top 0.2: DD6.13 44.29,55.39 43.3,54.4 40.3,54.4 R39.2
N$8
  Top 0.2: DD6.12 44.19,55.89 43.1,54.8 35.2,54.8 | C25.2 32.6,54.9 | ZQ1.3 33.97,56.03
  Top 0.25: 32.6,54.9 ZQ1.3 | 33.97,56.03 35.2,54.8
N$9
  Top 0.2: DD6.47 58.34,45.44 58,45.1 57.4,45.1 R25.1
N$10
  Top 0.25: DD13.5 R79.1
N$11  (via drill 0.6 pad 1.27)
  Top 0.25: v11,63 19,63 20,64 v20,66.6
  Bottom 0.25: BAT1.1 11,66.69 v11,63 | v20,66.6 v20.01,66.61 XP8.3
N$12
  Top 0.25: R6.1 34.12,43.39 L1.2
N$13  (via drill 0.6 pad 1.27)
  Top 0.25: v117.9,65.7 116.4,65.7 v114.8,67.3 113.8,66.3 v109.3,66.3 108.1,66.3 v105.8,68.6 | v125.9,34.6 121.7,30.41 DD17.4
  Bottom 0.25: DD11.13 114.8,69.11 v114.8,67.3 | DD11.17 109.3,67.42 v109.3,66.3 | 107.77,70.47 DD11.21 105.95,68.6 v105.8,68.6 | DD11.9 117.3,71.14 117.3,68.6 117.9,68 v117.9,65.7 117.9,59.8 118.7,58.9 127.2,58.9 129.3,56.8 129.3,38 v125.9,34.6
N$14
  Top 0.25: VT1.3 R79.2
N$15
  Top 0.25: R78.1 73.5,69.44 R77.2
N$16
  Top 0.406: R17.2 26.85,29.25 VD3.C
N$17
  Bottom 0.25: R14.2 51.13,84.7 XP1.19
N$18
  Bottom 0.25: R15.2 49,83.79 XP1.17
N$19
  Bottom 0.25: 40.6,84.33 XP1.11 40.72,82.18 R16.2
N$20
  Top 0.25: R30.1 2.82,31.2 XP2.4
  Bottom 0.25: DD5.3 13.94,30.14 13.4,29.6 2.78,29.6 XP2.4
N$21
  Top 0.25: R31.1 3.06,28.9 XP2.5
  Bottom 0.25: 2.06,27.9 XP2.5 3.26,29.1 16.9,29.1 17.75,29.95 DD5.6
N$22
  Top 0.25: R32.1 3.2,24.1 XP2.6
  Bottom 0.25: DD5.8 19.02,27.98 18.4,28.6 5.3,28.6 XP2.6
N$23  (via drill 0.6 pad 1.27)
  Top 0.25: DD9.9 98.8,87.8 v98.4,88.2
  Bottom 0.25: DD8.3 76.29,83.29 81,88 81.2,88.2 v98.4,88.2
N$24
  Top 0.2: 36.27,51.87 ZQ1.1 | 37.5,53.8 R39.1
  Top 0.25: C26.2 36.27,51.87 | ZQ1.1 37.5,53.8
N$25
  Top 0.406: R67.2 31.45,29.35 VD25.C
N$26  (via drill 0.6 pad 1.27)
  Top 0.2: DD7.9 85.8,81.2 v86.4,81.7
  Bottom 0.2: DD8.6 72.03,79.4
  Bottom 0.25: 72.03,79.4 84.1,79.4 v86.4,81.7
N$27  (via drill 0.6 pad 1.27)
  Top 0.25: DD4.12 10.88,9.41 10.2,10.1 10.2,12.6 v5.9,16.9
  Bottom 0.25: DD5.11 15.21,27.19 14.9,27.5 11.1,27.5 10.5,26.9 10.5,24.1 10.2,23.8 10.2,21.1 R33.1 5.9,17.8 v5.9,16.9
N$28
  Top 0.25: DD3.1 105.39,19.5 C2.2
N$29
  Top 0.25: DD3.3 102.86,19.66 C2.1
N$30
  Top 0.25: DD3.2 104.12,16.38 104.9,15.6 106.8,15.6 C4.2
N$31
  Top 0.25: DD3.4 101.58,19.48 C8.2
N$32
  Top 0.25: DD3.5 100.31,19.68 C8.1
N$33
  Top 0.25: DD3.6 99.05,19.05 C10.2
N$34
  Top 0.2: DD6.7 44.2,58.4 43.1,59.5 42.2,59.5 40.4,61.3 40.4,63.3 35.79,67.91 R53.1
N$35
  Bottom 0.25: DD10.3 115.95,82.7 115.3,82.7 112.1,79.5 112.1,79 111.4,78.3 111.4,77.6 111.7,77.3 112.39,77.3 DD11.2 112.79,77.79
N$36
  Top 0.25: DD4.15 10.47,13.22 7.1,16.6 7.1,17.9 3,22 XP7.1
N$37
  Top 0.25: DD4.1 6.05,14.75 4.3,16.5 4.3,18.4 3.7,19 2.46,19 XP7.2
N$38
  Top 0.25: DD4.2 4.78,13.22 4.2,13.8 4.2,15.6 3.4,16.4 2.52,16.4 XP7.3
N$39
  Top 0.25: DD4.3 5.04,11.96 3,14 2.38,14 XP7.4
N$40
  Top 0.25: DD4.4 3.15,10.69 XP7.5
N$41
  Top 0.25: DD4.5 2.12,9.41 XP7.6
N$42
  Top 0.25: DD4.6 4.14,8.14 3,7 2.24,7 XP7.7
N$43
  Top 0.25: DD4.7 4.88,6.88 4,6 4,5 3,4 2.22,4 XP7.8
N$44
  Bottom 0.25: XP9.D+ 123.65,79.4 122.2,79.4 120,81.6 119.2,81.6 118.95,81.35 DD10.6
N$45
  Bottom 0.25: DD10.4 118.75,82.65 119.2,82.2 120.1,82.2 121.55,80.75 XP9.D-
N$46
  Bottom 0.25: DD10.1 115.95,81.3 114.6,81.3 112.6,79.3 112.6,78.64 DD11.1 112.35,78.35
N$47
  Bottom 0.25: R76.2 107.28,77.76 DD11.29
N$48
  Bottom 0.25: DD11.30 105.1,81.08 105.1,82.4 107.29,84.59 ZQ3.1 105.19,85.81 104,87 103.89,87 C42.2
N$49
  Bottom 0.25: R76.1 105.29,79.71 104.4,80.6 103.2,80.6 102.4,79.8 101.28,79.8 ZQ3.2 100.47,82.68 C43.2
N$50
  Top 0.25: VT1.1 73.45,66.05 R78.2 73.46,66.1 R74.1
N$51
  Bottom 0.406: XP23.2VBUS 120.47,12.3 L7.1
N$52  (via drill 0.6 pad 1.27)
  Top 0.25: DD13.4 70.9,59.3 71.4,59.3 71.6,59.1 v74.5,59.1
  Bottom 0.25: DD14.4 100.55,69.75 100.2,70.1 84.5,70.1 75.6,61.2 75.6,59.6 75.1,59.1 v74.5,59.1
N$53  (via drill 0.6 pad 1.27)
  Top 0.25: DD13.6 71.1,60.9 v74.5,60.9
  Bottom 0.25: DD14.5 100.65,71.05 100.2,70.6 84.2,70.6 v74.5,60.9
N$54
  Top 0.406: VD5.C 72.7,26.15 R20.2
N$55
  Top 0.2: DD6.48 58.84,44.64 R26.1
N$56
  Top 0.25: R81.2 108.4,30.6 109,30 110.18,30 R82.1 111.8,28.62 111.8,29.2 113,30.41 DD17.5
N$57
  Bottom 0.25: XP12.2 98.04,41.34 R47.1
N$58
  Bottom 0.25: XP12.1 R46.1
N$59
  Top 0.406: R70.2 77.45,29.45 VD27.C
N$60
  Top 0.406: VD7.C 68.2,26.05 R23.2
N$61
  Bottom 0.25: DD12.5 124.68,49 XP22.1D+
N$62
  Bottom 0.25: XP22.1D- 123.8,47 125.6,48.8 126.32,48.8 DD12.4
N$63
  Bottom 0.25: XP22.2D- 120.67,47.03 119.37,47.03 118.7,47.7 118.3,47.7 117.7,48.3 117.08,48.3 DD15.4 117.08,48.4
N$64
  Bottom 0.25: XP22.2D+ 122,47.67 122,46.3 121.4,45.7 120,45.7 118.5,47.2 117.18,47.2 DD15.5
N$65
  Bottom 0.25: XP23.2D+ 120.9,17 121.9,16 121.9,14.2 121.5,13.8 120.1,13.8 118.8,15.1 118.06,15.1 DD16.5
N$66
  Bottom 0.25: XP23.2D- 120.2,15 118.8,16.4 118.06,16.4 DD16.4
N$67
  Top 0.2: DD6.59 60.52,53.4 arc-45 60.14,53.56 59.82,53.88 arc-45 59.7,54.17 59.7,60.92 arc-45 60.07,61.57 60.88,62.38 arc45 61,62.77 61,70.33 arc-45 61.33,71.13 62.45,72.25 R52.2
N$68
  Bottom 0.406: L6.2 118.78,19.5 XP23.2GND
N$69
  Bottom 0.406: L5.1 120.17,44 XP22.2VBUS
N$70
  Bottom 0.25: L4.2 118.94,51.5
  Bottom 0.406: 118.94,51.5 XP22.2GND
N$71
  Bottom 0.406: 123.29,42.2 XP22.1VBUS
  Bottom 0.61: L3.1 123.29,42.2
N$72
  Bottom 0.406: XP22.1GND 123.1,51.69 L2.2
N$73
  Top 0.406: R70.1 80.35,22.75 R71.1 80.6,21.4 80.6,14 78.9,12.3 VD28.C
N$74  (via drill 0.6 pad 1.27)  (1 unrouted)
  Top 0.61: 113.07,43 C44.A | v123,39 123,38.95 C49.A | C49.A 117.5,33.45 117.5,29.8 116.83,29.14 DD17.6 115.47,29.1 113.2,29.1 113,28.9 113,27.9 113.03,27.86 | 113.03,27.86 DD17.7 | 113.03,27.86 113,27.83 113,26.9 113.31,26.59 DD17.8 113.6,26.6 113,26 v113,14.3 113,9.19 | 113.07,43 113.07,42.66 C49.A | 113.07,43 v115.8,43
  Bottom 0.406: v115.8,43 117,44 | 123.2,39.2 L3.2
  Bottom 0.61: 117,44 L5.2 | v123,39 123.2,39.2 | L7.2 115,12.3 v113,14.3
N$75  (via drill 0.6 pad 1.27)
  Top 0.25: C52.1 109.8,28.48 R82.2 108.8,28.5 107.5,29.8 107.5,35.9 103.5,39.9 103.5,59.7 102.8,60.4 102.8,63.5 104.5,65.2 v111.3,65.2
  Bottom 0.25: DD11.18 110.75,70 111.2,70 | DD11.22 108.22,72 111.2,72 | 111.2,70 111.2,72 | DD11.10 115.31,72 111.2,72 | DD11.14 112.78,70 111.2,70 | v111.3,65.2 111.2,65.3 111.2,70
N$76
  Top 0.2: DD6.58 60.22,52.89 arc-45 59.86,53.04 59.48,53.41 arc-45 59.3,53.86 59.3,60.94 arc-45 59.62,61.72 60.42,62.52 arc45 60.5,62.72 R85.2
N$78
  Top 0.406: R34.2 63.65,29.45 VD9.C
N$79
  Top 0.2: R86.2 75.63,54.3 arc45 75.06,54.06 74.09,53.09 arc-45 73.39,52.8 71.38,52.8 arc-45 70.9,53 69.5,54.4 arc45 68.29,54.9 DD6.62
  Top 0.25: DD6.62
N$80
  Top 0.25: DD4.11 12.25,8.2 R87.2
N$81
  Top 0.25: 64.76,60.39 C14.2
  Top 0.3: DD6.73 64.76,60.39
N$82
  Top 0.3: DD6.49 59.34,45.51 C23.2 60.85,44 R36.2
N$83
  Top 0.25: DD6.19 43.09,52.39 41.5,50.8 R24.2 | R24.2 41.4,49.9 | R29.2 41.3,49.9 R24.2
N$85
  Top 0.406: R38.2 59.05,29.45 VD11.C
N$89
  Top 0.406: R42.2 54.45,29.45 VD13.C
N$93
  Top 0.406: R49.2 49.85,29.45 VD16.C
N$97
  Top 0.406: R54.2 45.25,29.45 VD19.C
N$101
  Top 0.406: R59.2 40.65,29.45 VD21.C
N$105
  Top 0.406: R63.2 36.05,29.45 VD23.C
NAND0_EN  (via drill 0.6 pad 1.27)
  Top 0.25: v74.7,80.8 74.5,80.6 v61.4,80.6 | v51.1,77.7 50.6,77.2 50.6,76.7 49.34,75.44 DD6.97
  Bottom 0.25: R48.2 74.12,82.02 DD8.4 73.48,82.02 v74.7,80.8 | v61.4,80.6 61,81 54.4,81 52.4,79 51.4,79 51.1,78.7 v51.1,77.7
NAND1_EN  (via drill 0.6 pad 1.27)
  Top 0.25: v73.4,87.1 73.4,82.5 72.1,81.2 62.8,81.2 62.2,81.8 60.3,81.8 v60.3,82.2 | v49.4,77.7 49.4,77.2 48.84,76.64 DD6.98
  Bottom 0.25: 71.6,86.18 R58.2 | 71.6,86.18 DD8.1 | 71.6,86.18 71.6,86 71.8,85.8 72.1,85.8 v73.4,87.1 | v60.3,82.2 54.8,82.2 52.1,79.5 49.9,79.5 49.4,79 v49.4,77.7
NAND2_EN  (via drill 0.6 pad 1.27)
  Top 0.25: DD6.1 43.01,61.39 42.4,62 42.4,75 42.7,75.3 44.5,75.3 44.8,75.6 46.9,75.6 47.3,75.2 v47.7,75.2
  Bottom 0.25: 63.1,81.9 R66.2 | DD8.10 65.76,80.8 64.2,80.8 63.1,81.9 | 63.1,81.9 62.6,81.4 62.6,79.7 62.3,79.4 60.7,79.4 59.6,80.5 54.6,80.5 52.6,78.5 52.6,77.1 52.4,76.9 52.25,76.75 52.1,76.6 48.3,76.6 47.7,76 v47.7,75.2
NAND3_EN  (via drill 0.6 pad 1.27)
  Top 0.25: DD6.2 42.81,60.89 41.8,61.9 41.8,75.3 42.3,75.8 44.2,75.8 44.6,76.2 46.9,76.2 47.7,77 v47.7,77.7
  Bottom 0.25: R72.2 67.9,85.4 67.1,84.6 65.85,84.6 DD8.13 65.77,84.6 56.4,84.6 51.8,80 49,80 47.7,78.7 v47.7,77.7
NAND_!WP  (via drill 0.6 pad 1.27)
  Top 0.2: R56.2 DD9.19 93.8,84.91 arc-90 93.29,84.4 83.16,84.4 arc90 80.6,81.84 R45.2 80.8,81 DD7.19 80.8,78.12 arc-90 79.78,77.1 78.58,77.1 arc-45 77.76,77.44 v76.9,78.3
  Top 0.25: DD6.3 42.6,60.4 41.3,61.7 41.3,64.2 40.7,64.8 v40.7,71.5
  Bottom 0.25: v40.7,71.5 41.3,72.1 48.9,72.1 50.1,70.9 52,70.9 53.6,72.5 55.4,72.5 57,70.9 58.9,70.9 59.6,71.6 66,71.6 66.6,72.2 73.4,72.2 73.9,72.7 73.9,78.1 74.6,78.8 76.4,78.8 v76.9,78.3
RAW_AN1
  Top 0.406: VD4.C 28.6,11.7 | VD4.C 28.4,11.8 | VD4.C 30,13.4 30,21.4 R18.1 29.75,22.75 R17.1
  Top 0.61: XP10.1 36.45,2.54 31.5,7.49 29.34,7.49 28.32,8.51 28.32,11.68 VD4.C
RAW_AN2
  Top 0.406: VD6.C 74.4,12.1 | VD6.C 74.7,11.7 | VD6.C 74.7,12 74.7,13.3 76.1,14.7 76.1,21.2 75.3,22 R21.1 75.75,22.65 R20.1
  Top 0.61: XP10.11 64.77,3.81 66.04,5.08 71.12,5.08 73.66,7.62 73.66,10.96 VD6.C
RAW_AN3
  Top 0.406: 70.3,11.6 VD8.C 71.5,13.5 71.5,21.2 70.7,22 R27.1 71.15,22.65 R23.1
  Top 0.61: XP10.10 62.23,3.81 64.77,6.35 68.58,6.35 69.85,7.62 69.85,11.55 VD8.C
RAW_AN4
  Top 0.406: VD10.C 65.6,11.5 | VD10.C 66.8,13.4 66.8,21.2 66,22 R35.1 66.55,22.75 R34.1 | VD10.C 65,11.6
  Top 0.61: XP10.9 59.69,2.92 64.9,8.13 64.9,11.5 VD10.C
RAW_AN5
  Top 0.406: 61,11.7 VD12.C 62.3,13.4 62.3,21.3 61.5,22.1 R40.1 61.95,22.65 R38.1
  Top 0.61: XP10.8 57.15,3.81 60.45,7.11 60.45,11.55 VD12.C
RAW_AN6
  Top 0.406: 56.4,11.5 VD14.C 57.7,13.4 57.7,21.4 R43.1 57.35,22.65 R42.1
  Top 0.61: XP10.7 54.61,6.86 56.01,8.26 VD14.C
RAW_AN7
  Top 0.406: R49.1 52.75,22.65 R50.1 52.3,22.1 53.3,21.1 53.3,14 51.5,12.2 VD18.C 51.8,11.7
  Top 0.61: XP10.6 52.07,9.27 51.56,9.78 51.56,11.64 VD18.C
RAW_AN8
  Top 0.406: 47.4,11.7 VD20.C 48.5,13.4 48.5,21.3 47.7,22.1 R55.1 48.15,22.65 R54.1
  Top 0.61: XP10.5 49.53,6.48 46.99,9.02 46.99,11.51 VD20.C
RAW_AN9
  Top 0.406: 42.7,11.8 VD22.C 44,13.6 44,21.3 43.2,22.1 R60.1 43.55,22.55 R59.1
  Top 0.61: XP10.4 46.99,4.45 42.16,9.27 42.16,11.64 VD22.C
RAW_AN10
  Top 0.406: 38.2,11.7 VD24.C 39.3,13.5 39.3,21.2 38.5,22 R64.1 38.95,22.65 R63.1
  Top 0.61: XP10.3 44.45,4.7 42.04,7.11 39.12,7.11 38.1,8.13 38.1,11.1 VD24.C
RAW_AN11
  Top 0.406: 33.3,11.7 VD26.C 34.6,13.4 34.6,21.4 R68.1 34.35,22.75 R67.1
  Top 0.61: VD26.C 33.15,11.45 33.15,8.76 36.2,5.71 40.13,5.71 41.91,3.94 XP10.2
RESET  (via drill 0.6 pad 1.27)
  Top 0.2: 44.79,54.89 DD6.14 | C9.1 21.73,54.9
  Top 0.25: 21.73,54.9 23.1,54.9 29.6,48.4 37.4,48.4 39,50 39.9,50 44.79,54.89 | C9.1 19.51,55 S1.2 | v46.1,77.4 44.9,77.4 43.9,76.4 27,76.4 26,75.4 23.1,75.4 21.8,74.1 21.8,59.7 20.49,58.39 R9.1 20.09,58.1 S1.2 | S1.1 S1.2
  Bottom 0.25: XP1.15 45.8,77.8 v46.1,77.4
SPEEDOMETER  (via drill 0.6 pad 1.27)
  Top 0.25: DD6.64 70.11,55.89 70.9,55.1 72.8,55.1 v73.5,54.4
  Bottom 0.25: R47.2 98.1,44.7 VD17.C 98,46 97.4,46.6 83.2,46.6 75.4,54.4 v73.5,54.4
SPI_CE0  (via drill 0.6 pad 1.27)
  Top 0.2: DD6.91 52.34,61.04 51.3,60 48.6,60 46.7,61.9 43.3,61.9 42.9,62.3 42.9,69.3 v43.5,69.9
  Top 0.25: v15.8,45.8 11.1,45.8 10.2,44.9 10.2,37.3 v11.4,36.1
  Bottom 0.25: DD5.1 v11.4,36.1 | v15.8,45.8 15.8,76.3 17.6,78.1 30.9,78.1 39.6,69.4 43,69.4 v43.5,69.9
SPI_CE1  (via drill 0.6 pad 1.27)
  Top 0.2: DD6.92 51.84,61.14 51.1,60.4 48.8,60.4 46.9,62.3 43.6,62.3 43.3,62.6 43.3,67.9 45,69.6 45,70.4 v45.1,70.5
  Top 0.25: v15.2,34.3 10.3,34.3 9.5,35.1 9.5,45 10.9,46.4 13.3,46.4 v14.5,47.6
  Bottom 0.25: DD5.4 v15.21,34.29 v15.2,34.3 | v14.5,47.6 15.2,48.3 15.2,76.5 17.3,78.6 31.1,78.6 39.8,69.9 41.7,69.9 42.9,71.1 44.5,71.1 v45.1,70.5
SPI_CE2  (via drill 0.6 pad 1.27)
  Top 0.2: DD6.93 51.34,61.24 50.9,60.8 49,60.8 47.1,62.7 44.1,62.7 43.7,63.1 43.7,67.6 45.5,69.4 46,69.4 46.5,69.9 46.5,70.8 v46.8,71.1
  Top 0.25: v12.6,47.8 11.4,47.8 8.8,45.2 8.8,28.2 v9.4,27.6
  Bottom 0.25: DD5.10 16.48,27.52 15.9,28.1 9.9,28.1 v9.4,27.6 | v12.6,47.8 14.6,49.6 14.6,76.7 17,79.1 31.3,79.1 40,70.4 41.5,70.4 42.7,71.6 46.3,71.6 v46.8,71.1
SPI_CE3  (via drill 0.6 pad 1.27)
  Top 0.25: DD6.95 50.34,71.44 v50.9,72 | v12.6,23.6 11.1,23.6 8.2,26.5 8.2,45.3 v12.6,49.7
  Bottom 0.25: DD5.13 12.67,23.67 v12.6,23.6 | v50.9,72 50.3,72.6 38.6,72.6 31.5,79.7 16.8,79.7 14,76.9 14,51.1 v12.6,49.7
SPI_EXT_MISO  (via drill 0.6 pad 1.27)
  Top 0.2: DD6.53 60.61,50.39 60.3,50.7 49.2,50.7 43,44.5 v43,43
  Bottom 0.25: XP2.2 2.44,35.9 3.4,35.9 4.2,36.7 4.2,40.2 7.6,43.6 42.3,43.6 42.9,43 v43,43
SPI_EXT_MOSI  (via drill 0.6 pad 1.27)
  Top 0.2: DD6.54 60.81,50.89 60.8,50.9 60.7,50.9 60.5,51.1 49,51.1 41.4,43.5 v41.4,42.4
  Top 0.25: DD4.14 12.34,12.1 13.6,12.1 13.8,12.3 13.8,18.3 13.5,18.6 7.5,18.6 5.5,20.6 5.5,32.4 5,32.9 2.02,32.9 XP2.3
  Bottom 0.25: XP2.3 2.6,32.92 4.7,35.02 4.7,39.9 7.9,43.1 40.7,43.1 v41.4,42.4
SPI_EXT_NSS  (via drill 0.6 pad 1.27)
  Top 0.25: DD6.51 68.79,49.39 v69.4,50
  Bottom 0.25: DD5.2 12.67,33.97 14.3,35.6 | 13.9,25.77 DD5.12 14,25.75 14,24 14.4,23.6 17.3,23.6 17.75,24.05 DD5.9 17.9,25.66 17.9,24.2 18.4,23.7 20,23.7 20.5,24.2 20.5,34.9 20,35.4 17,35.4 16.48,34.88 DD5.5 16.5,31.97 16.5,35.1 16,35.6 14.3,35.6 | 14.3,35.6 14.3,41.2 15.6,42.5 39,42.5 40.3,41.2 42.1,41.2 42.8,41.9 52.8,41.9 52.9,42 63,42 69.4,48.4 v69.4,50
SPI_EXT_SCK  (via drill 0.6 pad 1.27)
  Top 0.2: DD6.52 60.51,49.89 60.1,50.3 49.4,50.3 44.6,45.5 v44.6,44.1
  Top 0.25: 3,38 XP2.1 6,38 7.2,36.8 7.2,21.2 8.6,19.8 15.3,19.8 16.3,18.8 16.3,8.4 R87.1
  Bottom 0.25: 2.1,38.1 XP2.1 2.3,38.3 2.3,39.1 7.3,44.1 v44.6,44.1
TACHOMETER  (via drill 0.6 pad 1.27)
  Top 0.25: DD6.63 69.81,55.39 70.9,54.3 71.4,54.3 v71.8,53.9
  Bottom 0.25: R46.2 VD15.C 84.3,44.8 83.7,45.4 83.55,45.55 75.8,53.3 72.5,53.3 71.9,53.9 v71.8,53.9
TCK  (via drill 0.6 pad 1.27)
  Top 0.25: DD6.76 59.84,70.76 59.2,71.4 59.2,73.6 58.6,74.2 v57.4,74.2 | R4.1 38.18,80.08 XP1.9
  Bottom 0.25: v57.4,74.2 57.3,74.1 39.6,74.1 36.2,77.5 36.2,82.7 37.95,84.45 XP1.9
TDI  (via drill 0.6 pad 1.27)
  Top 0.25: R2.1 33.1,80.1 XP1.5 | DD6.77 59.34,70.46 58.1,71.7 v58.1,72.1
  Bottom 0.25: v58.1,72.1 57.6,72.6 56.2,72.6 55.7,73.1 38.9,73.1 35,77 35,82.8 33.35,84.45 XP1.5
TDO
  Top 0.25: XP1.13 43.26,80.04 R5.1 52.7,80 53.34,79.36 DD6.89
TMS  (via drill 0.6 pad 1.27)
  Top 0.2: DD6.72 60.51,59.89 60.3,60.1 60.3,61.2 61.5,62.4 61.5,68.3
  Top 0.25: 61.5,68.3 61.5,69.4 v65.2,72.8 | R3.1 35.64,80.04 XP1.7
  Bottom 0.25: v65.2,72.8 64.8,73.2 56.5,73.2 56.1,73.6 39.3,73.6 35.64,77.26 XP1.7
TO_COM
  Top 0.25: XP5.3 94.26,2.66 93.1,1.5 90.9,1.5 90,2.4 90,6.9 92.6,9.5 96.1,9.5 96.5,9.9 DD3.9
TO_USART1  (via drill 0.6 pad 1.27)
  Top 0.25: DD6.69 73.1,58.4 73.6,57.9 75.3,57.9 75.8,58.4 77.3,58.4 v78.4,57.3 | DD3.7 97.5,17.57 97.5,22.8 90.6,29.7 90.6,45 v85.9,49.7
  Bottom 0.25: v85.9,49.7 85.9,49.8 v78.4,57.3
TRST
  Top 0.25: XP1.3 30,83.89 R1.1 30.5,79.4 30.6,79.3 52.3,79.3 52.84,78.76 DD6.90
USB_DISCOVERY  (via drill 0.6 pad 1.27)
  Top 0.25: DD6.66 v71.99,56.89 v72,56.9 | v70,69 71.16,69 R77.1
  Bottom 0.25: v72,56.9 72,67 v70,69
USB_DM
  Top 0.25: DD6.70 66.99,58.89 67.45,59.35 DD13.3
USB_DP
  Top 0.25: DD6.71 66.79,59.39 68.05,60.65 DD13.1
USB_HUB_DM1
  Bottom 0.25: DD12.3 128.3,50.78 128.3,51.7 128.8,52.2 128.8,56.6 127,58.4 117.9,58.4 116.5,59.8 116.5,69.7 115.17,71.03 DD11.11 115.14,70.96
USB_HUB_DM2
  Bottom 0.25: DD15.3 115.03,48.4 114.93,48.3 114.3,48.3 113.5,49.1 113.5,68 112.88,68.62 DD11.15
USB_HUB_DM3
  Bottom 0.25: DD16.3 116.05,16.4 115.1,16.4 114.8,16.1 113.6,16.1 110,19.7 110,63.6 108,65.6 108,68.38 DD11.19
USB_HUB_DM4
  Bottom 0.25: DD14.3 104.84,69.75 DD11.23
USB_HUB_DP1
  Bottom 0.25: DD12.1 126.87,51.17 128.3,52.6 128.3,56.4 126.8,57.9 117.7,57.9 115.9,59.7 115.9,69.3 114.73,70.47 DD11.12
USB_HUB_DP2
  Bottom 0.25: DD11.16 113,67.52 113,48.4 114.35,47.05 DD15.1
USB_HUB_DP3
  Bottom 0.25: DD16.1 115.27,15.13 114.8,15.6 113.4,15.6 109.5,19.5 109.5,63.4 107.5,65.4 107.5,69.01 DD11.20
USB_HUB_DP4
  Bottom 0.25: DD14.1 105.01,71.05 DD11.24
USB_PRESENT  (via drill 0.6 pad 1.27)
  Top 0.25: DD6.65 70.31,56.39 71,55.7 73.9,55.7 v74.3,56.1 | v93.4,48 94.48,48 100.2,42.28 100.2,34.2 103.48,30.92 R80.2
  Bottom 0.25: v74.3,56.1 74.9,56.1 83,48 v93.4,48
VBAT
  Top 0.2: DD6.6 44.31,58.89 43.3,59.9 42.4,59.9 40.8,61.5 40.8,63.5 35.7,68.6 | XP8.2 25.18,68.6
  Top 0.25: 25.18,68.6 35.7,68.6
VDD_A
  Top 0.25: DD6.22 44.7,50.9 | 44.7,50.9 44.5,51.1 44.5,51.2 44.69,51.39 DD6.21 | 44.7,50.9 44.4,50.9 R24.1 43.4,48.5 36.3,41.4 34.02,41.4 R6.2 33.95,39.58 C6.1
(copper drawn outside any net)
  shapes: Bottom area x4438

## Text on the board
Top: barthess